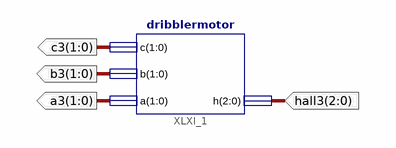
[diagram p0: schematic sheet 1]
// Xilinx ISE schematic test1.sch (spartan6) as structural Verilog: 1 symbols, 4 ports
module test1 (
  input  [2:0] hall3,
  output [1:0] a3,
  output [1:0] b3,
  output [1:0] c3
);

  dribblermotor XLXI_1 (.h(hall3), .a(a3), .b(b3), .c(c3));
endmodule
